# EAGLE design upperBoard (EAGLE 7.0.0)
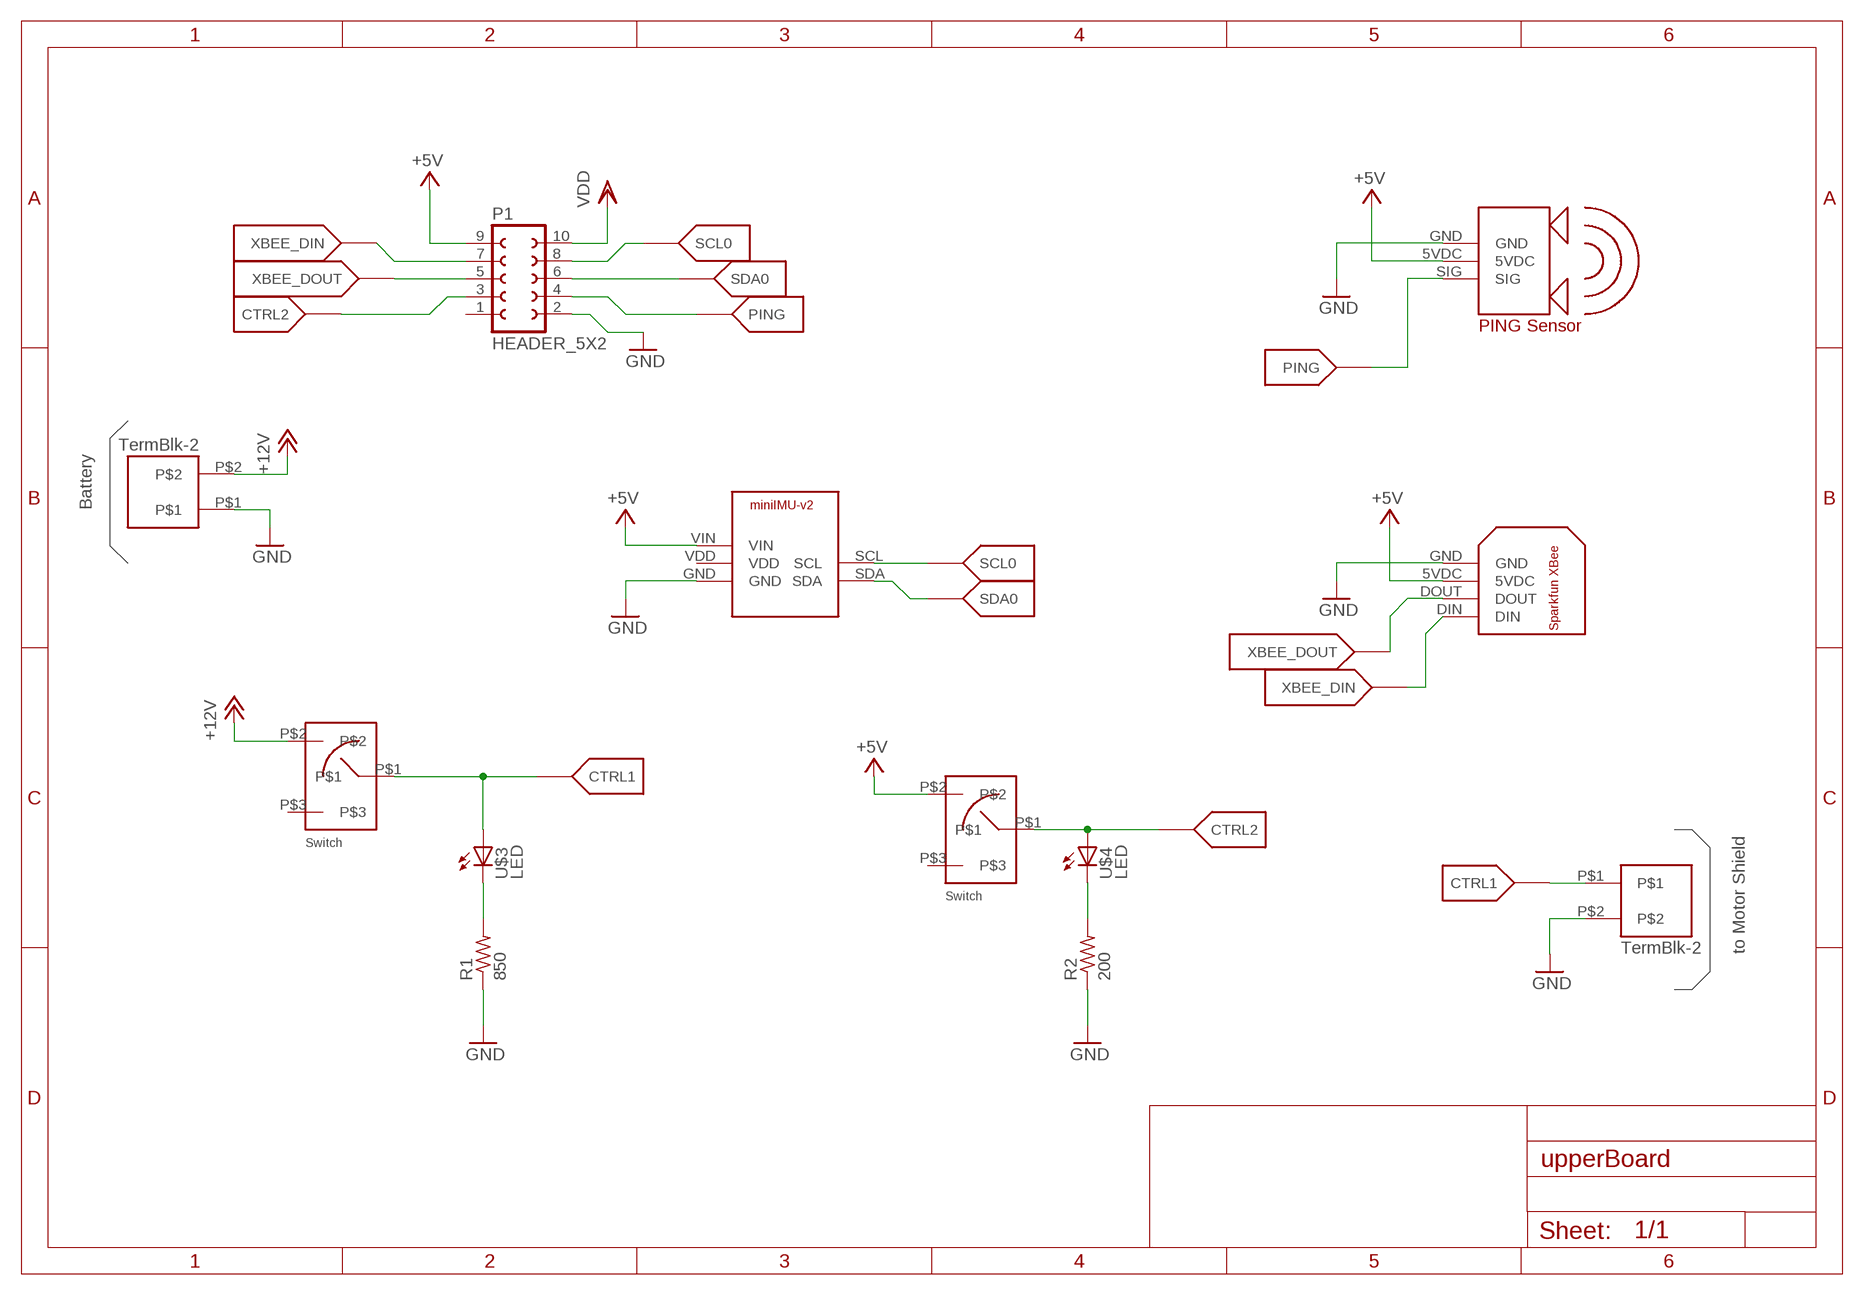
[diagram p0: schematic, sheet 1]

## Parts
P1  HEADER_5X2  [HEADER_5X2]
R1  850  RESISTOR  [RESISTOR_PKG]
R2  200  RESISTOR  [RESISTOR_PKG]
U$1  SWITCH-SPST  [SWITCH-SPST]
U$2  SWITCH-SPST  [SWITCH-SPST]
U$3  LED  [LED_PKG]
U$4  LED  [LED_PKG]
U$7  POLOLU_MINIIMU9_V2  [POLOLU_IMU9V2]
U$8  SPARKFUNXBEE  [SPARKFUNXBEE]
U$9  PARALLAX_PING  [PING]
U$16  TB2  [TB2_PKG]
U$18  TB2  [TB2_PKG]

## Nets
+5V: P1.9 U$2.P$2 U$7.VIN U$8.5VDC U$9.5VDC
+12V: U$1.P$2 U$16.P$2
CTRL1: U$1.P$1 U$3.A U$18.P$1
CTRL2: P1.3 U$2.P$1 U$4.A
GND: P1.2 R1.1 R2.1 U$7.GND U$8.GND U$9.GND U$16.P$1 U$18.P$2
N$5: R1.2 U$3.K(C)
N$7: R2.2 U$4.K(C)
PING: P1.4 U$9.SIG
SCL0: P1.8 U$7.SCL
SDA0: P1.6 U$7.SDA
VDD: P1.10
XBEE_DIN: P1.7 U$8.DIN
XBEE_DOUT: P1.5 U$8.DOUT
Unconnected: P1.1 U$1.P$3 U$2.P$3 U$7.VDD

## Notes on the sheet
- Battery
- to Motor Shield

## Library data of the parts
P1 = LowerBoard_r1:HEADER_5X2
R1 R2 = myDevices:RESISTOR: 1/4 Watt Resistor
U$1 U$2 = myLibrary:SWITCH-SPST
U$3 U$4 = myDevices:LED: LED
U$7 = LowerBoard_r1:POLOLU_MINIIMU9_V2: Pololu miniIMU-9 v2
U$8 = myDevices:SPARKFUNXBEE: Sparkfun Xbee Breakout Board
U$9 = myDevices:PARALLAX_PING: Parallax Ping Sensor
U$16 U$18 = LowerBoard_r1:TB2: Terminal Block with 2 connections

## Net classes
0 default: width 0.203 mm, drill 0.406 mm, clearance 0.203 mm

## Board
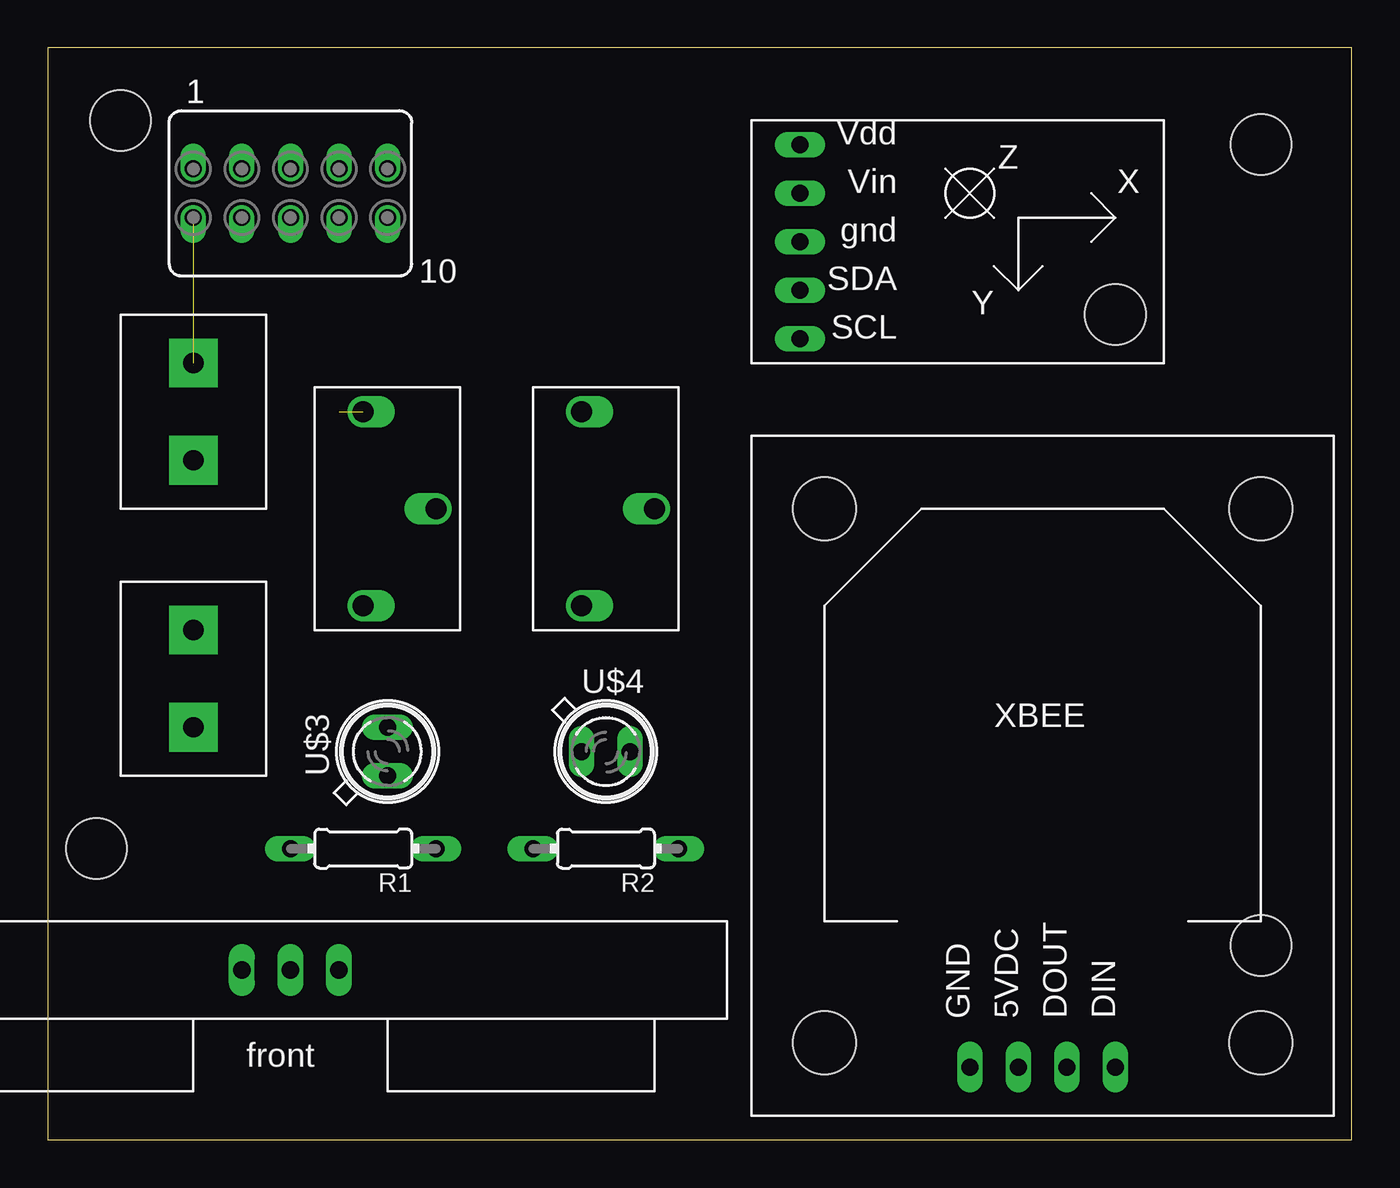
[diagram p1: board, top side]
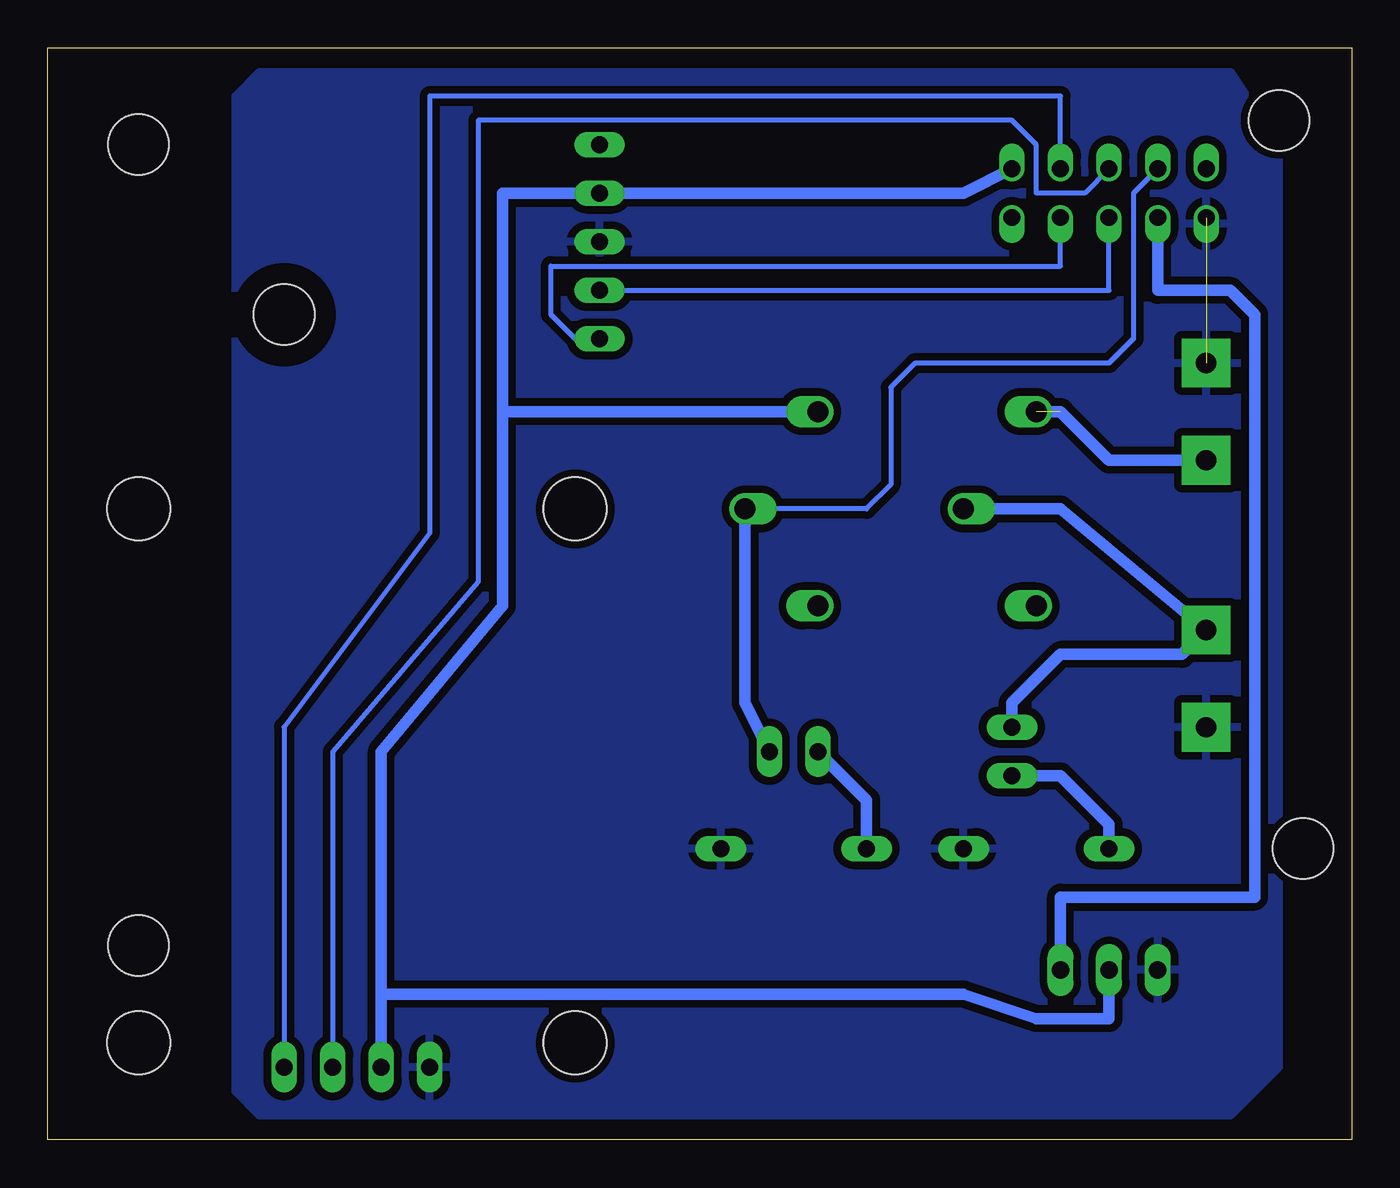
[diagram p2: board, bottom side, seen from below]

Size 68.25 x 57.14 mm. Coordinates in mm from the lower left corner, seen from the top.
Outline: 0,0 68.25,0 68.25,57.14 0,57.14 0,0
Copper layers (1*16): Top 0.035mm / dielectric 1.6mm / Bottom 0.035mm
Design rules "DAZL": minimum track width 0.2mm, minimum drill 35mil, track to track 0.401mm, track to pad 0.401mm, pad to pad 0.401mm, via to via 0.401mm, smd to smd 6mil, copper to edge 0.404mm, drill to drill 1mm, minimum pad ring 0.2mm, minimum via ring 0.2mm, stop-mask expansion 2mil, vias tented up to drill 25mil, thermal gap 16mil
Holes 3.17 mm at 2.54,15.24 3.81,53.34 63.5,52.07 63.5,10.16

### Footprints (pad centres in the part's own frame; a part is rotated, then mirrored left to right if it is on the bottom)
HEADER_5X2 = drill 0.889 offset: 1 -5.08,1.27 | drill 0.889 pad 1.27 offset: 2 -5.08,-1.27; 3 -2.54,1.27; 4 -2.54,-1.27; 5 0,1.27; 6 0,-1.27; 7 2.54,1.27; 8 2.54,-1.27; 9 5.08,1.27; 10 5.08,-1.27
RESISTOR_PKG = drill 0.889 long: 1 -3.81,0; 2 3.81,0
SWITCH-SPST = drill 1.1 offset: P$1 0,0; P$2 -3.81,5.08; P$3 -3.81,-5.08
LED_PKG = drill 0.889 long: A 1.27,0; K -1.27,0
POLOLU_IMU9V2 = drill 0.889 long: GND 5.08,-1.27; SCL 5.08,3.81; SDA 5.08,1.27; VDD 5.08,-6.35; VIN 5.08,-3.81 | hole 3.175: -11.43,2.54
SPARKFUNXBEE = drill 0.889 long: 5VDC -1.27,0; DIN 3.81,0; DOUT 1.27,0; GND -3.81,0 | hole 3.302: 11.43,1.27; -11.43,1.27; -11.43,29.21; 11.43,29.21
PING = drill 0.9 long: 5VDC -2.54,0; GND -2.54,2.54; SIG -2.54,-2.54
TB2_PKG = drill 1.067 pad 2.54 square: P$1 0,2.54; P$2 0,-2.54

### Placement (x,y rotation side)
DRILEGEND  [DRILEGEND]  -10.22,-3.81 0 top  (outside the outline)
P1  12.7,49.53 0 top
R1  16.51,15.24 180 top
R2  29.21,15.24 180 top
U$1  20.32,33.02 0 top
U$2  31.75,33.02 0 top
U$3  17.78,20.32 90 top
U$4  29.21,20.32 0 top
U$7  44.45,45.72 180 top
U$8  52.07,3.81 0 top
U$9  12.7,11.43 90 top
U$16  7.62,38.1 0 top
U$18  7.62,24.13 0 top

### Tracks (layer width: path | path; a pad name or v marks a point on that pad's centre or on a via)
+5V
  Bottom 0.61: U$8.5VDC 50.8,7.62 | 50.8,7.62 50.8,20.32 44.45,27.94 44.45,38.1 | 44.45,38.1 44.45,49.53 U$7.VIN 20.32,49.53 P1.9 | U$9.5VDC 12.7,6.35 16.51,6.35 20.32,7.62 50.8,7.62 | U$2.P$2 44.45,38.1
+12V  (1 unrouted)
  Bottom 0.61: U$16.P$2 12.7,35.56 15.24,38.1 17.78,38.1
CTRL1
  Bottom 0.61: U$3.A 17.78,22.86 15.24,25.4 8.89,25.4 U$18.P$1 15.24,33.02 U$1.P$1
CTRL2
  Bottom 0.254: P1.3 11.43,49.53 11.43,41.91 12.7,40.64 22.86,40.64 24.13,39.37 24.13,34.29 25.4,33.02 U$2.P$1
  Bottom 0.61: U$2.P$1 31.75,22.86 U$4.A
GND  (1 unrouted)
  pour Bottom: 6.35,55.88 3.81,52.07 3.81,3.81 6.35,1.27 57.15,1.27 58.42,2.54 58.42,54.61 57.15,55.88
N$5
  Bottom 0.61: U$3.K 15.24,19.05 12.7,16.51 R1.2
N$7
  Bottom 0.61: U$4.K 25.4,17.78 R2.2
PING
  Bottom 0.61: U$9.SIG 15.24,12.7 5.08,12.7 5.08,43.18 6.35,44.45 10.16,44.45 P1.4
SCL0
  Bottom 0.254: U$7.SCL 40.64,41.91 41.91,43.18 41.91,45.72 15.24,45.72 P1.8
SDA0
  Bottom 0.254: U$7.SDA 12.7,44.45 P1.6
XBEE_DIN
  Bottom 0.254: P1.7 15.24,54.61 48.26,54.61 48.26,31.75 55.88,21.59 U$8.DIN
XBEE_DOUT
  Bottom 0.254: P1.5 13.97,49.53 16.51,49.53 16.51,52.07 17.78,53.34 45.72,53.34 45.72,29.21 53.34,20.32 U$8.DOUT

### Text on the board
DrillLegend: LAYER-STACK
DrillLegend_01-16: 01-16
DrillLegend_01-20: 01-20